# Altium project trusted_io_evt2.PrjPcb (part 2 of 2)

## Sheet 05_kbd_pm.SchDoc
size B
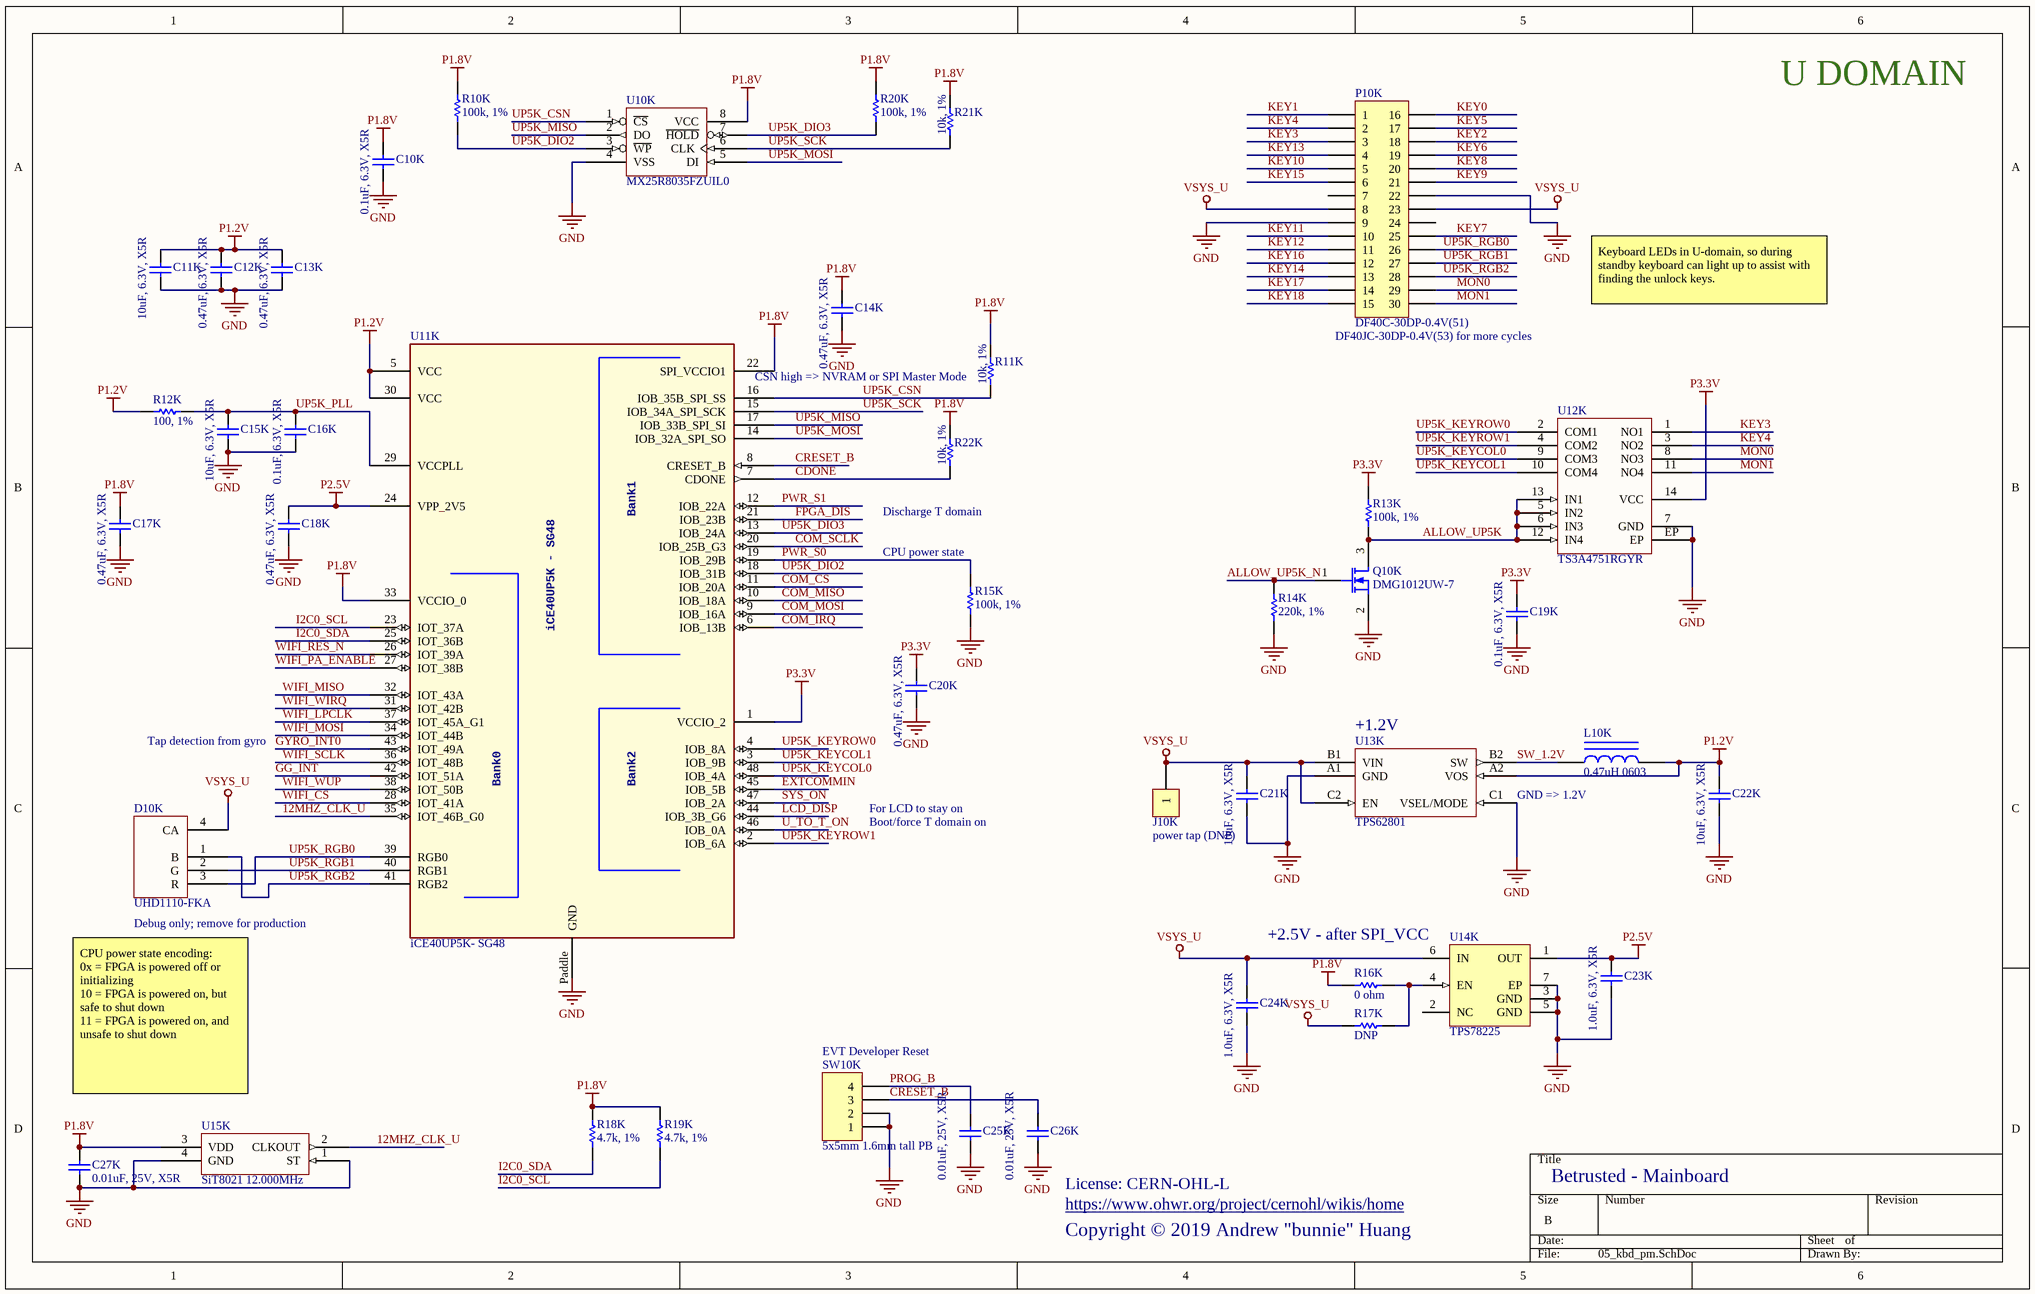
[diagram p6: 05_kbd_pm.SchDoc]

### Parts
C10K  0.1uF, 6.3V, X5R  [B_CAP0201]
C11K  10uF, 6.3V, X5R  [B_CAP0603]
C12K  0.47uF, 6.3V, X5R  [B_CAP0201]
C13K  0.47uF, 6.3V, X5R  [B_CAP0201]
C14K  0.47uF, 6.3V, X5R  [B_CAP0201]
C15K  10uF, 6.3V, X5R  [B_CAP0603]
C16K  0.1uF, 6.3V, X5R  [B_CAP0201]
C17K  0.47uF, 6.3V, X5R  [B_CAP0201]
C18K  0.47uF, 6.3V, X5R  [B_CAP0201]
C19K  0.1uF, 6.3V, X5R  [B_CAP0201]
C20K  0.47uF, 6.3V, X5R  [B_CAP0201]
C21K  10uF, 6.3V, X5R  [B_CAP0603]
C22K  10uF, 6.3V, X5R  [B_CAP0603]
C23K  1.0uF, 6.3V, X5R  [B_CAP0201]
C24K  1.0uF, 6.3V, X5R  [B_CAP0201]
C25K  0.01uF, 25V, X5R  [B_RES0201]
C26K  0.01uF, 25V, X5R  [B_RES0201]
C27K  0.01uF, 25V, X5R  [B_RES0201]
D10K  UHD1110-FKA  [CREE_UHD1110-FKA]
J10K  power tap (DNP)  [RESTAP-0603]
L10K  0.47uH 0603  [B_IND0603]
P10K  DF40C-30DP-0.4V(51)  [HRS_DF40C-30DP-0.4V(51)]
Q10K  DMG1012UW-7  [SOT323-3AN]
R10K  100k, 1%  [B_RES0201]
R11K  10k, 1%  [B_RES0201]
R12K  100, 1%  [B_RES0402]
R13K  100k, 1%  [B_RES0201]
R14K  220k, 1%  [B_RES0201]
R15K  100k, 1%  [B_RES0201]
R16K  0 ohm  [B_RES0201]
R17K  DNP  [B_RES0201]
R18K  4.7k, 1%  [B_RES0201]
R19K  4.7k, 1%  [B_RES0201]
R20K  100k, 1%  [B_RES0201]
R21K  10k, 1%  [B_RES0201]
R22K  10k, 1%  [B_RES0201]
SW10K  5x5mm 1.6mm tall PB  [SWITCH_TS-1187A]
U10K  MX25R8035FZUIL0  [USON-8]
U11K  iCE40UP5K- SG48  [UP5K_QFN127P600-8N]
U12K  TS3A4751RGYR  [TI_RGY_S_PVQFN-N14]
U13K  TPS62801  [BGA6C35P2X3_70X105X40_NSMD]
U14K  TPS78225  [TI-DRV6-1600X1000TP_V]
U15K  SiT8021 12.000MHz  [SiTIME_CSP]

### Nets
GND: C10K.2 C11K.2 C12K.2 C13K.2 C14K.2 C15K.2 C16K.2 C17K.2 C18K.2 C19K.2 C20K.2 C21K.2 C22K.2 C23K.2 C24K.2 C25K.2 C26K.2 C27K.2 P10K.9 P10K.22 Q10K.2(S) R14K.1 R15K.1 SW10K.1 SW10K.2 U10K.4(VSS) U11K.Paddle(GND) U12K.7(GND) U12K.EP U13K.A1(GND) U13K.C1(VSEL/MODE) U14K.3(GND) U14K.5(GND) U14K.7(EP) U15K.1(ST) U15K.4(GND)
P1.2V: C11K.1 C12K.1 C13K.1 C22K.1 L10K.2 R12K.2 U11K.5(VCC) U11K.30(VCC) U13K.A2(VOS)
P1.8V: C10K.1 C14K.1 C17K.1 C27K.1 R10K.2 R11K.1 R16K.1 R18K.2 R19K.2 R20K.2 R21K.1 R22K.1 U10K.8(VCC) U11K.22(SPI_VCCIO1) U11K.33(VCCIO_0) U15K.3(VDD)
P2.5V: C18K.1 C23K.1 U11K.24(VPP_2V5) U14K.1(OUT)
P3.3V: C19K.1 C20K.1 R13K.2 U11K.1(VCCIO_2) U12K.14(VCC)
VSYS_U: C21K.1 C24K.1 D10K.4(CA) J10K.1 P10K.8 P10K.23 R17K.1 U13K.B1(VIN) U13K.C2(EN) U14K.6(IN)
12MHZ_CLK_U: U11K.35(IOT_46B_G0) U15K.2(CLKOUT)
ALLOW_UP5K: Q10K.3(D) R13K.1 U12K.5(IN2) U12K.6(IN3) U12K.12(IN4) U12K.13(IN1)
ALLOW_UP5K_N: Q10K.1(G) R14K.2
CDONE: R22K.2 U11K.7(CDONE)
COM_CS: U11K.11(IOB_20A)
COM_IRQ: U11K.6(IOB_13B)
COM_MISO: U11K.10(IOB_18A)
COM_MOSI: U11K.9(IOB_16A)
COM_SCLK: U11K.20(IOB_25B_G3)
CRESET_B: C26K.1 SW10K.3 U11K.8(CRESET_B)
EXTCOMMIN: U11K.45(IOB_5B)
FPGA_DIS: U11K.21(IOB_23B)
GG_INT: U11K.42(IOT_51A)
GYRO_INT0: U11K.43(IOT_49A)
I2C0_SCL: R19K.1 U11K.23(IOT_37A)
I2C0_SDA: R18K.1 U11K.25(IOT_36B)
KEY0: P10K.16
KEY1: P10K.1
KEY2: P10K.18
KEY3: P10K.3 U12K.1(NO1)
KEY4: P10K.2 U12K.3(NO2)
KEY5: P10K.17
KEY6: P10K.19
KEY7: P10K.25
KEY8: P10K.20
KEY9: P10K.21
KEY10: P10K.5
KEY11: P10K.10
KEY12: P10K.11
KEY13: P10K.4
KEY14: P10K.13
KEY15: P10K.6
KEY16: P10K.12
KEY17: P10K.14
KEY18: P10K.15
LCD_DISP: U11K.44(IOB_3B_G6)
MON0: P10K.29 U12K.8(NO3)
MON1: P10K.30 U12K.11(NO4)
PROG_B: C25K.1 SW10K.4
PWR_S0: R15K.2 U11K.19(IOB_29B)
PWR_S1: U11K.12(IOB_22A)
SW_1.2V: L10K.1 U13K.B2(SW)
SYS_ON: U11K.47(IOB_2A)
U_TO_T_ON: U11K.46(IOB_0A)
UP5K_CSN: R11K.2 U10K.1(~{CS}) U11K.16(IOB_35B_SPI_SS)
UP5K_DIO2: R10K.1 U10K.3(~{WP}) U11K.18(IOB_31B)
UP5K_DIO3: R20K.1 U10K.7(~{HOLD}) U11K.13(IOB_24A)
UP5K_KEYCOL0: U11K.48(IOB_4A) U12K.9(COM3)
UP5K_KEYCOL1: U11K.3(IOB_9B) U12K.10(COM4)
UP5K_KEYROW0: U11K.4(IOB_8A) U12K.2(COM1)
UP5K_KEYROW1: U11K.2(IOB_6A) U12K.4(COM2)
UP5K_MISO: U10K.2(DO) U11K.17(IOB_33B_SPI_SI)
UP5K_MOSI: U10K.5(DI) U11K.14(IOB_32A_SPI_SO)
UP5K_PLL: C15K.1 C16K.1 R12K.1 U11K.29(VCCPLL)
UP5K_RGB0: D10K.3(R) P10K.26 U11K.39(RGB0)
UP5K_RGB1: D10K.2(G) P10K.27 U11K.40(RGB1)
UP5K_RGB2: D10K.1(B) P10K.28 U11K.41(RGB2)
UP5K_SCK: R21K.2 U10K.6(CLK) U11K.15(IOB_34A_SPI_SCK)
WIFI_CS: U11K.28(IOT_41A)
WIFI_LPCLK: U11K.37(IOT_45A_G1)
WIFI_MISO: U11K.32(IOT_43A)
WIFI_MOSI: U11K.34(IOT_44B)
WIFI_PA_ENABLE: U11K.27(IOT_38B)
WIFI_RES_N: U11K.26(IOT_39A)
WIFI_SCLK: U11K.36(IOT_48B)
WIFI_WIRQ: U11K.31(IOT_42B)
WIFI_WUP: U11K.38(IOT_50B)
NetR16K_2: R16K.2 R17K.2 U14K.4(EN)

Not connected (* = marked no-connect by the designer): P10K 7 24; U14K 2(NC)

### Notes on the sheet
- U DOMAIN
- Keyboard LEDs in U-domain, so during standby keyboard can light up to assist with finding the unlock keys.
- (near P10K) DF40JC-30DP-0.4V(53) for more cycles
- CSN high => NVRAM or SPI Master Mode
- (near R15K) CPU power state
- (near R22K) Discharge T domain
- Tap detection from gyro
- (near U13K) +1.2V
- Boot/force T domain on
- For LCD to stay on
- GND => 1.2V
- (near D10K) Debug only; remove for production
- (near U14K) +2.5V - after SPI_VCC
- CPU power state encoding:
  0x = FPGA is powered off or initializing
  10 = FPGA is powered on, but safe to shut down
  11 = FPGA is powered on, and unsafe to shut down
- (near SW10K) EVT Developer Reset
- Betrusted - Mainboard
- (near C26K) License: CERN-OHL-L
- Copyright © 2019 Andrew "bunnie" Huang
- https://www.ohwr.org/project/cernohl/wikis/home
- (in symbol iCE40UP5K- SG48) Bank1; iCE40UP5K - SG48; Bank0; Bank2

### Library data of the parts
C10K C16K C19K = Cap Semi: as C12F on sheet 01_fpga
C11K C15K C21K C22K = Cap Semi: as C11F on sheet 01_fpga
C12K C13K C14K C17K C18K C20K = Cap Semi: Capacitor (Semiconductor SIM Model); MPN: CL03A474KQ3NNNH; VENDOR: Samsung; MYPN: C-474-6p3-X5R-0201
C23K C24K = Cap Semi: as C22F on sheet 01_fpga
C25K C26K C27K = Cap Semi: Capacitor (Semiconductor SIM Model); MPN: GRM033R61E103KA12D; VENDOR: Murata; MYPN: C-103-25-X5R-0201
D10K = CREE_UHD1110-FKA: 1x1mm SMD RGB LED, 5mA, common anode; MPN: UHD1110-FKA-CL1A13R3Q1BBQFMF3; VENDOR: Cree; MYPN: UHD1110-FKA
J10K = CON1: Connector; MYPN: J-TP-PWRTAP-0603; MPN: DNP; VENDOR: DNP
L10K = Inductor Iron: Magnetic-Core Inductor; MPN: TFM160808ALC-R47MTAA; VENDOR: TDK; MYPN: L-TFM160808ALC-R47MTAA
P10K = Header 15X2A: Header, 15-Pin, Dual row; MYPN: J-DF40C-30DP-0.4V(51) or DF40JC-30DP-0.4V(53); VENDOR: Hirose; System: Connector; LatestRevisionDate: 17-Jul-2002; LatestRevisionNote: Re-released for DXP Platform.; Publisher: Altium Limited; MPN: DF40C-30DP-0.4V(51)
Q10K = MOSFET-N: as Q11F on sheet 01_fpga; Published: 8-Jun-2000; LatestRevisionDate: 17-Jul-2002; LatestRevisionNote: Re-released for DXP Platform.; PackageVersion: 1995/1996; PackageReference: E3; Publisher: Altium Limited; MPN: DMG1012UW-7
R10K R13K R15K R20K = Res1: as R14F on sheet 01_fpga; MPN: ANY
R11K R21K R22K = Res1: Resistor; VENDOR: ANY; MYPN: R-103-1P-1_16W-0201; MPN: ANY
R12K = Res1: Resistor; VENDOR: ANY; MYPN: R-101-1P-1_16W-0402; MPN: ANY
R14K = Res1: as R10F on sheet 01_fpga; MPN: ANY
R16K = Res1: Resistor; VENDOR: ANY; MYPN: R-0R0-1P-1_16W-0201; MPN: ANY
R17K = Res1: Resistor; VENDOR: ANY; MYPN: DNP; MPN: ANY
R18K R19K = Res1: Resistor; VENDOR: ANY; MYPN: R-472-1P-1_16W-0201; MPN: ANY
SW10K = Header 4: Chi Fung TS-1187A; MPN: RS-187R05A2-DS MT RT; VENDOR: C&K; MYPN: SW-PB-5X5-1.6; LatestRevisionDate: 17-Jul-2002; LatestRevisionNote: Re-released for DXP Platform.; Publisher: Altium Limited
U10K = EN25P05-50GCP: 64Mbit SPI NOR FLASH; MYPN: UMX25R8035FZUIL0; VENDOR: Macronix; MPN: MX25R8035FZUIL0
U12K = TS3A4751RGYR: 0.9 ohm low voltage, single supply, 4-channel SPST analog switch; MYPN: U-TS3A4751RGYR; VENDOR: TI; MPN: TS3A4751RGYR
U13K = TPS62801: Buck regulator, 4MHz, 0.6A, 0.8V-1.55V, low Iq; MPN: TPS62801YKAT; VENDOR: TI; MYPN: U-TPS62801YKA(T/R)
U14K = TI-TPS78225-Q1DRV6-1600X1000TP: 500nA Iq, 150mA LDO; MPN: TPS78225DRVT; VENDOR: TI; MYPN: U-TPS78225DRV(T/R)
U15K = SiT8021: 1 to 26 MHz micropower oscillator; MPN: SIT8021AI-J4-18S-12.000000E; VENDOR: SiTime; MYPN: U-SIT8021AI-J4-18S-12.000000E

## Sheet 07_ux.SchDoc
size B
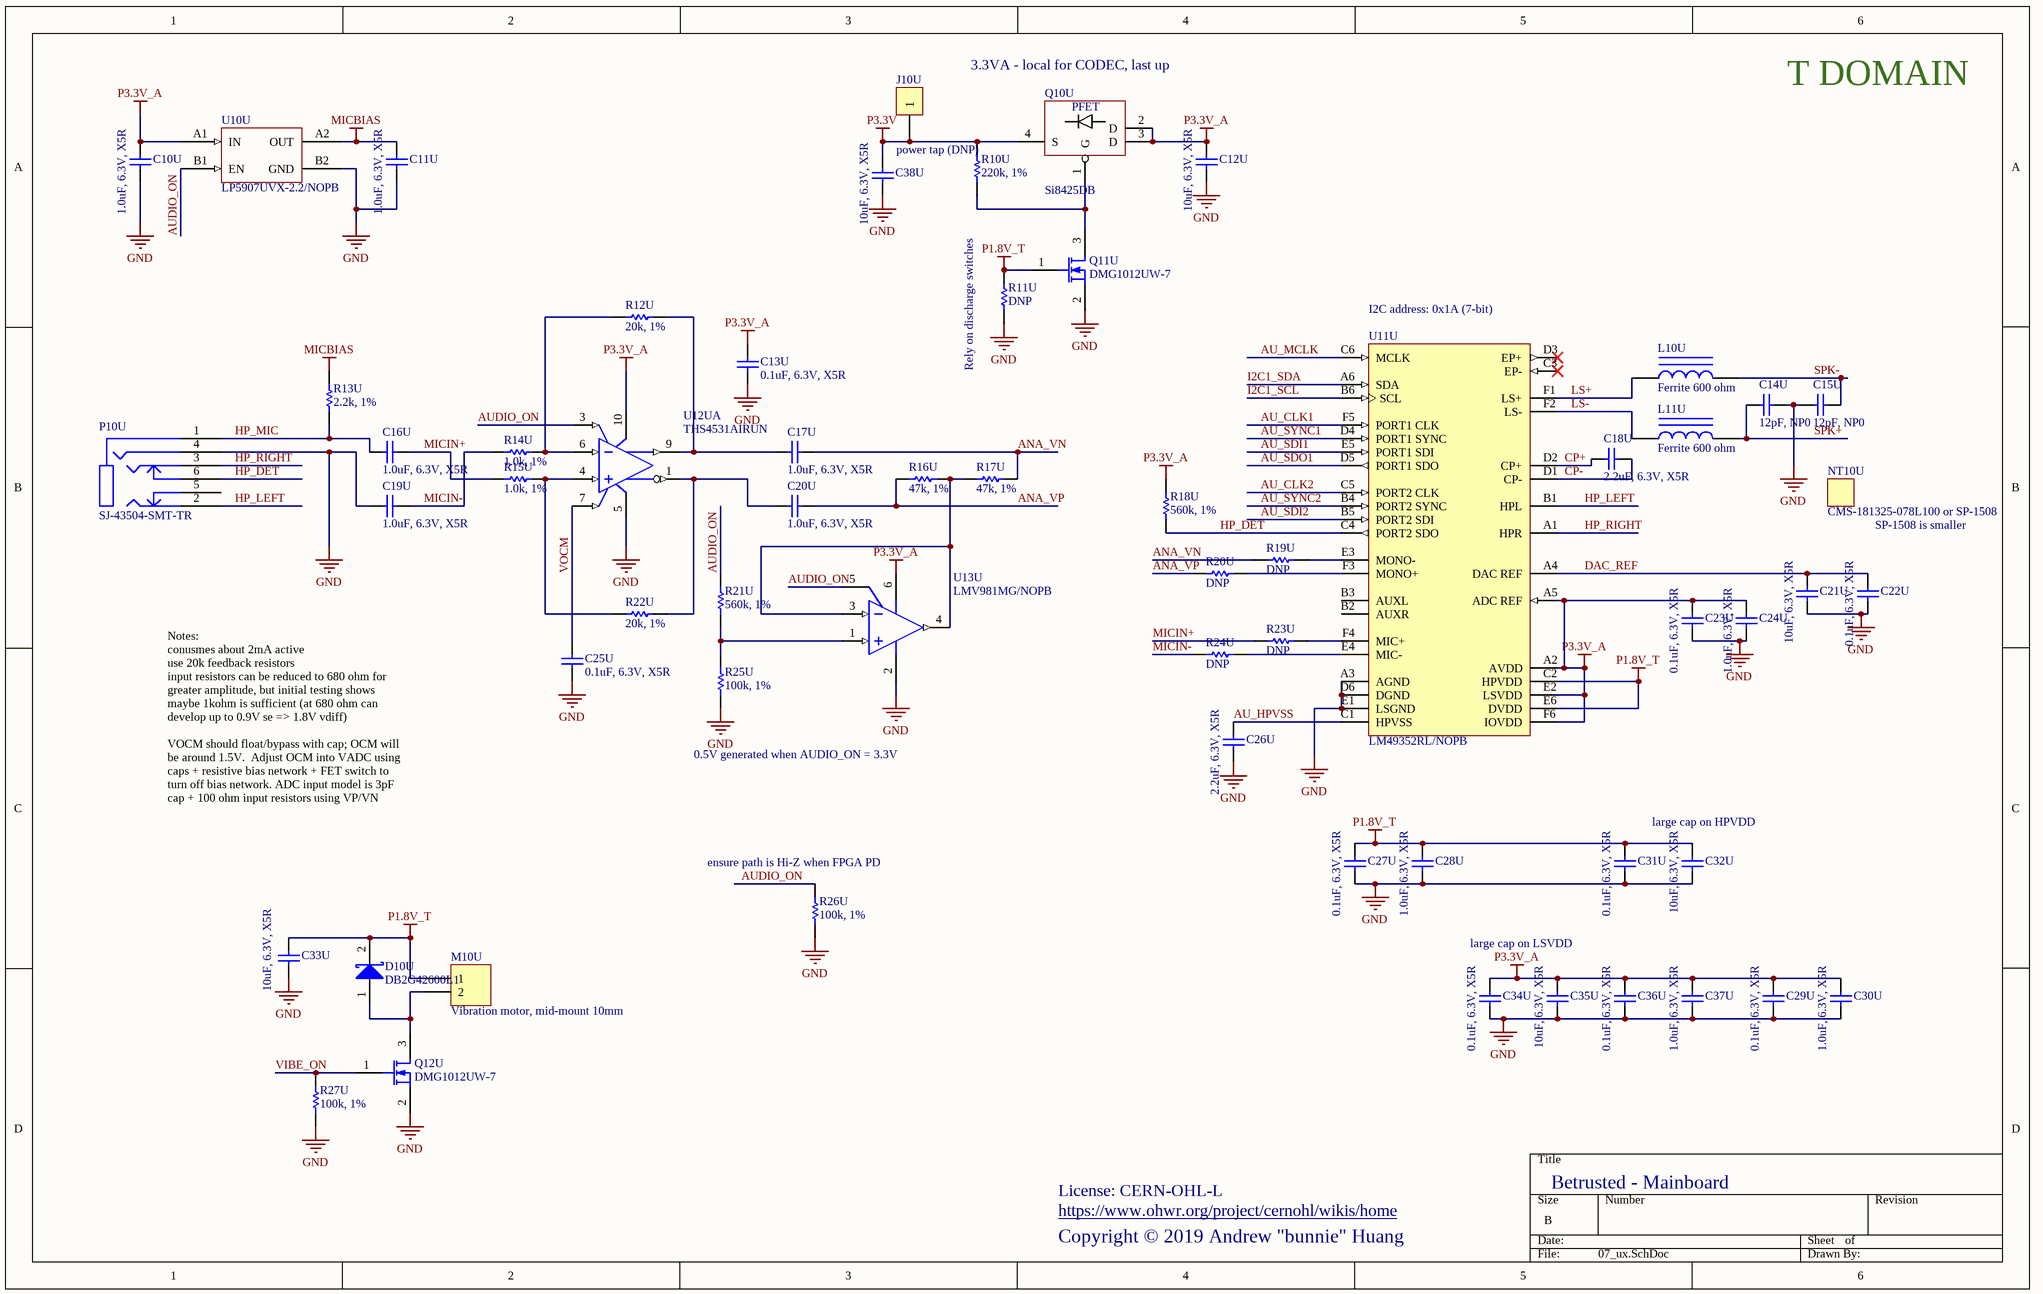
[diagram p7: 07_ux.SchDoc]

### Parts
C10U  1.0uF, 6.3V, X5R  [B_CAP0201]
C11U  1.0uF, 6.3V, X5R  [B_CAP0201]
C12U  10uF, 6.3V, X5R  [B_CAP0603]
C13U  0.1uF, 6.3V, X5R  [B_CAP0201]
C14U  12pF, NP0  [B_CAP0201]
C15U  12pF, NP0  [B_CAP0201]
C16U  1.0uF, 6.3V, X5R  [B_CAP0201]
C17U  1.0uF, 6.3V, X5R  [B_CAP0201]
C18U  2.2uF, 6.3V, X5R  [B_CAP0402]
C19U  1.0uF, 6.3V, X5R  [B_CAP0201]
C20U  1.0uF, 6.3V, X5R  [B_CAP0201]
C21U  10uF, 6.3V, X5R  [B_CAP0603]
C22U  0.1uF, 6.3V, X5R  [B_CAP0201]
C23U  0.1uF, 6.3V, X5R  [B_CAP0201]
C24U  1.0uF, 6.3V, X5R  [B_CAP0201]
C25U  0.1uF, 6.3V, X5R  [B_CAP0201]
C26U  2.2uF, 6.3V, X5R  [B_CAP0402]
C27U  0.1uF, 6.3V, X5R  [B_CAP0201]
C28U  1.0uF, 6.3V, X5R  [B_CAP0201]
C29U  0.1uF, 6.3V, X5R  [B_CAP0201]
C30U  1.0uF, 6.3V, X5R  [B_CAP0201]
C31U  0.1uF, 6.3V, X5R  [B_CAP0201]
C32U  10uF, 6.3V, X5R  [B_CAP0603]
C33U  10uF, 6.3V, X5R  [B_CAP0603]
C34U  0.1uF, 6.3V, X5R  [B_CAP0201]
C35U  10uF, 6.3V, X5R  [B_CAP0603]
C36U  0.1uF, 6.3V, X5R  [B_CAP0201]
C37U  1.0uF, 6.3V, X5R  [B_CAP0201]
C38U  10uF, 6.3V, X5R  [B_CAP0603]
D10U  DB2G42600L1  [B_DIO0402]
J10U  power tap (DNP)  [RESTAP-0603]
L10U  Ferrite 600 ohm  [B_IND0603]
L11U  Ferrite 600 ohm  [B_IND0603]
M10U  Vibration motor, mid-mount 10mm  [JINLONG-C1020K001F]
NT10U  CMS-181325-078L100 or SP-1508
P10U  SJ-43504-SMT-TR  [CUI_SJ_43504_SMT_TR_FLIP]
Q10U  Si8425DB  [VISHAY_MICRO_FOOT_4_BUMP]
Q11U  DMG1012UW-7  [SOT323-3AN]
Q12U  DMG1012UW-7  [SOT323-3AN]
R10U  220k, 1%  [B_RES0201]
R11U  DNP  [B_RES0201]
R12U  20k, 1%  [B_RES0201]
R13U  2.2k, 1%  [B_RES0201]
R14U  1.0k, 1%  [B_RES0201]
R15U  1.0k, 1%  [B_RES0201]
R16U  47k, 1%  [B_RES0201]
R17U  47k, 1%  [B_RES0201]
R18U  560k, 1%  [B_RES0201]
R19U  DNP  [B_RES0201]
R20U  DNP  [B_RES0201]
R21U  560k, 1%  [B_RES0201]
R22U  20k, 1%  [B_RES0201]
R23U  DNP  [B_RES0201]
R24U  DNP  [B_RES0201]
R25U  100k, 1%  [B_RES0201]
R26U  100k, 1%  [B_RES0201]
R27U  100k, 1%  [B_RES0201]
U10U  LP5907UVX-2.2/NOPB  [TI_YKE004]
U11U  LM49352RL/NOPB  [YPG0036AWAW]
U12U  THS4531AIRUN  [RUN0010A]  (part A of 2)
U13U  LMV981MG/NOPB  [DCK0006A_N]

### Nets
GND: C10U.2 C11U.2 C12U.2 C13U.1 C14U.2 C15U.1 C19U.1 C21U.2 C22U.2 C23U.2 C24U.1 C25U.1 C26U.1 C27U.2 C28U.1 C29U.2 C30U.1 C31U.2 C32U.2 C33U.1 C34U.2 C35U.2 C36U.2 C37U.1 C38U.2 P10U.4(RING2) Q11U.2(S) Q12U.2(S) R11U.1 R25U.1 R26U.1 R27U.1 U10U.B2(GND) U11U.A3(AGND) U11U.D6(DGND) U11U.E1(LSGND) U12U.5(VS-) U13U.2(GND)
MICBIAS: C11U.1 R13U.2 U10U.A2(OUT)
P1.8V_T: C27U.1 C28U.2 C31U.1 C32U.1 C33U.2 D10U.2(K) M10U.1 Q11U.1(G) R11U.2 U11U.C2(HPVDD) U11U.E6(DVDD)
P3.3V: C38U.1 J10U.1 Q10U.4(S) R10U.2
P3.3V_A: C10U.1 C12U.1 C13U.2 C23U.1 C24U.2 C29U.1 C30U.2 C34U.1 C35U.1 C36U.1 C37U.2 Q10U.2(D) Q10U.3(D) R18U.2 U10U.A1(IN) U11U.A2(AVDD) U11U.A5(ADC_REF) U11U.E2(LSVDD) U11U.F6(IOVDD) U12U.10(VS+) U13U.6(VDD)
ANA_VN: C17U.2 R17U.1 R19U.2
ANA_VP: C20U.2 R16U.2 R20U.2
AU_CLK1: U11U.F5(PORT1_CLK)
AU_CLK2: U11U.C5(PORT2_CLK)
AU_HPVSS: C26U.2 U11U.C1(HPVSS)
AU_MCLK: U11U.C6(MCLK)
AU_SDI1: U11U.E5(PORT1_SDI)
AU_SDI2: U11U.B5(PORT2_SDI)
AU_SDO1: U11U.D5(PORT1_SDO)
AU_SYNC1: U11U.D4(PORT1_SYNC)
AU_SYNC2: U11U.B4(PORT2_SYNC)
AUDIO_ON: R21U.2 R26U.2 U10U.B1(EN) U12U.3(~{PD}) U13U.5(~{SHDN})
CP+: C18U.2 U11U.D2(CP+)
CP-: C18U.1 U11U.D1(CP-)
DAC_REF: C21U.1 C22U.1 U11U.A4(DAC_REF)
HP_DET: P10U.6(RING1_SW) R18U.1 U11U.C4(PORT2_SDO)
HP_LEFT: P10U.2(TIP) U11U.B1(HPL)
HP_MIC: C16U.1 P10U.1(SLEEVE) R13U.1
HP_RIGHT: P10U.3(RING1) U11U.A1(HPR)
I2C1_SCL: U11U.B6(SCL)
I2C1_SDA: U11U.A6(SDA)
LS+: L10U.1 U11U.F1(LS+)
LS-: L11U.1 U11U.F2(LS-)
MICIN+: C16U.2 R15U.2 R23U.2
MICIN-: C19U.2 R14U.2 R24U.2
SPK+: C14U.1 L11U.2
SPK-: C15U.2 L10U.2
VIBE_ON: Q12U.1(G) R27U.2
VOCM: C25U.2 U12U.7(VOCM)
NetC17U_1: C17U.1 R12U.1 U12U.9(VOUT+)
NetC20U_1: C20U.1 R22U.1 U12U.1(VOUT-)
NetD10U_1: D10U.1(A) M10U.2 Q12U.3(D)
NetQ10U_1: Q10U.1(G) Q11U.3(D) R10U.1
NetR12U_2: R12U.2 R14U.1 U12U.6(VIN-)
NetR15U_1: R15U.1 R22U.2 U12U.4(VIN+)
NetR16U_1: R16U.1 R17U.2 U13U.3(IN-) U13U.4(OUT)
NetR19U_1: R19U.1 U11U.E3(MONO-)
NetR20U_1: R20U.1 U11U.F3(MONO+)
NetR21U_1: R21U.1 R25U.2 U13U.1(IN+)
NetR23U_1: R23U.1 U11U.F4(MIC+)
NetR24U_1: R24U.1 U11U.E4(MIC-)

Not connected (* = marked no-connect by the designer): P10U 5(TIP_SW); U11U B2(AUXR) B3(AUXL) C3(EP-)* D3(EP+)*

### Notes on the sheet
- 3.3VA - local for CODEC, last up
- T DOMAIN
- Rely on discharge switches
- (near U11U) I2C address: 0x1A (7-bit)
- SP-1508 is smaller
- 0.5V generated when AUDIO_ON = 3.3V
- Notes:
  conusmes about 2mA active
  use 20k feedback resistors
  input resistors can be reduced to 680 ohm for greater amplitude, but initial testing shows maybe 1kohm is sufficient (at 680 ohm can develop up to 0.9V se => 1.8V vdiff)
  VOCM should float/bypass with cap; OCM will be around 1.5V.  Adjust OCM into VADC using caps + resistive bias network + FET switch to turn off bias network. ADC input model is 3pF cap + 100 ohm input resistors using VP/VN
- large cap on HPVDD
- (near R26U) ensure path is Hi-Z when FPGA PD
- large cap on LSVDD
- License: CERN-OHL-L
- Copyright © 2019 Andrew "bunnie" Huang
- https://www.ohwr.org/project/cernohl/wikis/home
- Betrusted - Mainboard
- (in symbol Si8425DB) PFET

### Library data of the parts
C10U C11U C16U C17U C19U C20U = Cap Semi: Capacitor (Semiconductor SIM Model); MPN: GRM033R60J105MEA2D; VENDOR: Murata; MYPN: C-105-6p3-X5R-0603
C12U C21U C32U C33U C35U C38U = Cap Semi: Capacitor (Semiconductor SIM Model); MPN: CL10A106MQ8NNNC; VENDOR: Samsung; MYPN: C-106-6.3-X5R-0603
C13U C22U C23U C25U C27U C29U C31U C34U C36U = Cap Semi: Capacitor (Semiconductor SIM Model); MPN: CL03A104KQ3NNNC; VENDOR: Samsung; MYPN: C-104-6p3-X5R-0201
C14U C15U = Cap Semi: Capacitor (Semiconductor SIM Model); MPN: GRM0335C1E120JA01D; VENDOR: Murata; MYPN: C-120-25-NP0-0201
C18U C26U = Cap Semi: Capacitor (Semiconductor SIM Model); MPN: CL05A225MQ5NNNC; VENDOR: Samsung; MYPN: C-225-6p3-X5R-0402
C24U C28U C30U C37U = Cap Semi: Capacitor (Semiconductor SIM Model); MPN: GRM033R60J105MEA2D; VENDOR: Murata; MYPN: C-105-6p3-X5R-0201
D10U = Diode 11DQ03: Schottky Rectifier; MYPN: D-SCHOTTKY-0402-CSP; VENDOR: Panasonic; ComponentLink1Description: Manufacturer Link; ComponentLink1URL: http://www.irf.com/; ComponentLink2Description: Datasheet; ComponentLink2URL: http://www.irf.com/product-info/datasheets/data/11dq03.pdf; MPN: DB2G42600L1
J10U = CON1: Connector; MYPN: J-TP-PWRTAP-0603; MPN: DNP; VENDOR: DNP
L10U L11U = Inductor Iron: Magnetic-Core Inductor; MPN: BLM18AG601SN1D; VENDOR: Murata; MYPN: L-BLM18AG601SN1D
M10U = Header 2: MPN: C1020K001F; VENDOR: Jinlong; MYPN: M-VIBE-10MM-MID; LatestRevisionDate: 17-Jul-2002; LatestRevisionNote: Re-released for DXP Platform.; Publisher: Altium Limited
NT10U = NOTE: Placeholder for non-board BOM items; MYPN: NT-CUI-SPEAKER; VENDOR: CUI or Soberton; MPN: CMS-181325-078L100 or SP-1508
P10U = CUI_3.5MM_STEREO_MIC: Mid mount audio jack; VENDOR: CUI; MYPN: J-3.5MM-MID-CUI; MPN: SJ-43504-SMT-TR
Q10U = Si8425DB: P-channel 20V 6.2A 27mOhm @ -2.5V; MPN: SI8457DB-T1-E1; VENDOR: Vishay Siliconix; MYPN: Q-Si8457
Q11U Q12U = MOSFET-N: N-Channel MOSFET; VENDOR: Diodes Inc; MYPN: Q-DMG1012UW-7; Published: 8-Jun-2000; LatestRevisionDate: 17-Jul-2002; LatestRevisionNote: Re-released for DXP Platform.; PackageVersion: 1995/1996; PackageReference: E3; Publisher: Altium Limited; MPN: DMG1012UW-7
R10U = Res1: Resistor; VENDOR: ANY; MYPN: R-224-1P-1_16W-0201; MPN: ANY
R11U R19U R20U R23U R24U = Res1: Resistor; VENDOR: ANY; MYPN: DNP; MPN: ANY
R12U R22U = Res1: Resistor; VENDOR: ANY; MYPN: R-203-1P-1_16W-0201; MPN: ANY
R13U = Res1: Resistor; VENDOR: ANY; MYPN: R-222-1P-1_16W-0201; MPN: ANY
R14U R15U = Res1: Resistor; VENDOR: ANY; MYPN: R-102-1P-1_16W-0201; MPN: ANY
R16U R17U = Res1: Resistor; VENDOR: ANY; MYPN: R-473-1P-1_16W-0201; MPN: ANY
R18U R21U = Res1: Resistor; VENDOR: ANY; MYPN: R-564-1P-1_16W-0201; MPN: ANY
R25U R26U R27U = Res1: Resistor; VENDOR: ANY; MYPN: R-104-1P-1_16W-0201; MPN: ANY
U10U = LP5907UVX: Ultra low-noise 250mA LDO for RF and analog in DSBGA; VENDOR: TI; MYPN: ULP5907UVX-2.2; MPN: LP5907UVX-2.2/NOPB
U11U = AMP-AUDA-LM49352-36: MYPN: U-LM49352RL/NOPB; VENDOR: TI; MPN: LM49352RL/NOPB
U12U = TI-THS4531X-RUN10: Ultra Low-Power, RRIO, Fully Differential Amplifier; MPN: THS4531AIRUNT; VENDOR: TI; MYPN: U-THS4531AIRUN(T/R)
U13U = CMP-0055-01099-3: Single 1.8V, RRIO Operational Amplifiers with Shutdown, 6-pin SC-70, Pb-Free; PowerWise: N; PackageTopMarking: A77*XTT; VENDOR: Texas Instruments; ComponentLink1URL: http://www.ti.com/general/docs/lit/getliterature.tsp?genericPartNumber=LMV981-N&fileType=pdf; PackageDescription: Molded SC-70, 2 x 1.25 x .9mm, 6 Lead, 0.65mm Pitch; RoHS: Y; PinCount: 6; ComponentLink1Description: Datasheet URL; CompType: Amplifiers; Package Reference: DCK0006A; MPN: LMV981MG/NOPB

## Nets that join several sheets
GND: 01_fpga (163 pins), 02_memory (17 pins), 03_power (54 pins), 04_io (35 pins), 05_kbd_pm (36 pins), 07_ux (38 pins)
P1.2V: 03_power (R19P.1), 05_kbd_pm (9 pins)
P1.8V: 01_fpga (5 pins), 02_memory (13 pins), 03_power (9 pins), 04_io (16 pins), 05_kbd_pm (16 pins)
P1.8V_T: 01_fpga (62 pins), 02_memory (8 pins), 03_power (D10P.2 D11P.2), 07_ux (11 pins)
P3.3V: 03_power (C24P.1 L12P.2 U13P.A2), 04_io (L13W.2), 05_kbd_pm (5 pins), 07_ux (C38U.1 J10U.1 Q10U.4 R10U.2)
P3.3V_A: 01_fpga (21 pins), 07_ux (21 pins)
P5.0V: 03_power (C28P.1 C29P.1 U15P.B2), 04_io (5 pins)
PACK_P: 01_fpga (P11F.4 P11F.5 P11F.6), 03_power (C21P.2 J11P.1 TP10P.1 U11P.C3)
VBAT: 01_fpga (6 pins), 03_power (9 pins)
VBUS: 01_fpga (5 pins), 03_power (12 pins)
VSYS_U: 03_power (14 pins), 05_kbd_pm (10 pins)
ALLOW_UP5K_N: 01_fpga (U11F.U7), 05_kbd_pm (Q10K.1 R14K.2)
ANA_VN: 01_fpga (U11F.K9), 07_ux (C17U.2 R17U.1 R19U.2)
ANA_VP: 01_fpga (U11F.J10), 07_ux (C20U.2 R16U.2 R20U.2)
AU_CLK1: 01_fpga (U11F.D14), 07_ux (U11U.F5)
AU_CLK2: 01_fpga (U11F.F14), 07_ux (U11U.C5)
AU_MCLK: 01_fpga (U11F.D18), 07_ux (U11U.C6)
AU_SDI1: 01_fpga (U11F.D12), 07_ux (U11U.E5)
AU_SDI2: 01_fpga (U11F.A15), 07_ux (U11U.B5)
AU_SDO1: 01_fpga (U11F.C13), 07_ux (U11U.D5)
AU_SYNC1: 01_fpga (U11F.B15), 07_ux (U11U.D4)
AU_SYNC2: 01_fpga (U11F.B17), 07_ux (U11U.B4)
AUDIO_ON: 01_fpga (U11F.G13), 07_ux (5 pins)
COM_CS: 01_fpga (U11F.T15), 05_kbd_pm (U11K.11)
COM_IRQ: 01_fpga (U11F.M16), 05_kbd_pm (U11K.6)
COM_MISO: 01_fpga (U11F.P16), 05_kbd_pm (U11K.10)
COM_MOSI: 01_fpga (U11F.N18), 05_kbd_pm (U11K.9)
COM_SCLK: 01_fpga (U11F.R16), 05_kbd_pm (U11K.20)
CRESET_B: 01_fpga (P12F.4), 03_power (R22P.1 U14P.1), 05_kbd_pm (C26K.1 SW10K.3 U11K.8)
EXTCOMMIN: 04_io (P12W.4), 05_kbd_pm (U11K.45)
FPGA_DIS: 01_fpga (Q14F.1 Q15F.1 R23F.2), 05_kbd_pm (U11K.21)
GG_INT: 03_power (R18P.2 U11P.A1), 05_kbd_pm (U11K.42)
GYRO_INT0: 04_io (U14W.4), 05_kbd_pm (U11K.43)
I2C0_SCL: 01_fpga (P11F.18), 03_power (U10P.A4 U11P.A3), 04_io (U14W.13), 05_kbd_pm (R19K.1 U11K.23)
I2C0_SDA: 01_fpga (P11F.17), 03_power (U10P.B4 U11P.A2), 04_io (U14W.14), 05_kbd_pm (R18K.1 U11K.25)
I2C1_SCL: 01_fpga (R26F.1 U11F.C14 U18F.3), 07_ux (U11U.B6)
I2C1_SDA: 01_fpga (R25F.1 U11F.A14 U18F.4), 07_ux (U11U.A6)
KEY0: 01_fpga (U11F.F15), 05_kbd_pm (P10K.16)
KEY1: 01_fpga (U11F.E17), 05_kbd_pm (P10K.1)
KEY2: 01_fpga (U11F.G17), 05_kbd_pm (P10K.18)
KEY3: 01_fpga (U11F.E14), 05_kbd_pm (P10K.3 U12K.1)
KEY4: 01_fpga (U11F.E15), 05_kbd_pm (P10K.2 U12K.3)
KEY5: 01_fpga (U11F.H15), 05_kbd_pm (P10K.17)
KEY6: 01_fpga (U11F.G15), 05_kbd_pm (P10K.19)
KEY7: 01_fpga (U11F.H14), 05_kbd_pm (P10K.25)
KEY8: 01_fpga (U11F.H16), 05_kbd_pm (P10K.20)
KEY9: 01_fpga (U11F.H17), 05_kbd_pm (P10K.21)
KEY10: 01_fpga (U11F.E18), 05_kbd_pm (P10K.5)
KEY11: 01_fpga (U11F.F18), 05_kbd_pm (P10K.10)
KEY12: 01_fpga (U11F.G18), 05_kbd_pm (P10K.11)
KEY13: 01_fpga (U11F.E13), 05_kbd_pm (P10K.4)
KEY14: 01_fpga (U11F.H18), 05_kbd_pm (P10K.13)
KEY15: 01_fpga (U11F.F13), 05_kbd_pm (P10K.6)
KEY16: 01_fpga (U11F.H13), 05_kbd_pm (P10K.12)
KEY17: 01_fpga (U11F.J13), 05_kbd_pm (P10K.14)
KEY18: 01_fpga (U11F.K13), 05_kbd_pm (P10K.15)
LCD_DISP: 04_io (C28W.1 P12W.5), 05_kbd_pm (U11K.44)
LCD_SCLK: 01_fpga (U11F.A17), 04_io (P12W.1)
LCD_SCS: 01_fpga (U11F.C18), 04_io (P12W.3)
LCD_SI: 01_fpga (U11F.D17), 04_io (P12W.2)
PROG_B: 01_fpga (P12F.21 R24F.1 U11F.R8 U14F.1), 02_memory (U12M.A4), 05_kbd_pm (C25K.1 SW10K.4)
PWR_S0: 01_fpga (R27F.1 U11F.U6 U16F.C2 U17F.C2), 05_kbd_pm (R15K.2 U11K.19)
PWR_S1: 01_fpga (U11F.L13), 05_kbd_pm (U11K.12)
SPINOR_CSN: 01_fpga (U11F.M13), 02_memory (R13M.1 U12M.C2)
SPINOR_DQS: 01_fpga (U11F.R14), 02_memory (U12M.C3)
SPINOR_ECSN: 01_fpga (R30F.2 U11F.L16), 02_memory (U12M.A5)
SPINOR_IO2: 01_fpga (U11F.L14), 02_memory (U12M.C4)
SPINOR_IO3: 01_fpga (U11F.M15), 02_memory (U12M.D4)
SPINOR_IO4: 01_fpga (U11F.L17), 02_memory (U12M.D5)
SPINOR_IO5: 01_fpga (U11F.L18), 02_memory (U12M.E3)
SPINOR_IO6: 01_fpga (U11F.M14), 02_memory (U12M.E2)
SPINOR_IO7: 01_fpga (U11F.N14), 02_memory (U12M.E1)
SPINOR_MISO: 01_fpga (U11F.K18), 02_memory (U12M.D2)
SPINOR_MOSI: 01_fpga (U11F.K17), 02_memory (U12M.D3)
SPINOR_SCK: 01_fpga (U11F.C8), 02_memory (U12M.B2)
SPK+: 01_fpga (P11F.23 P11F.24), 07_ux (C14U.1 L11U.2)
SPK-: 01_fpga (P11F.25 P11F.26), 07_ux (C15U.2 L10U.2)
SRAM_A0: 01_fpga (U11F.V12), 02_memory (U10M.A3 U11M.A3)
SRAM_A1: 01_fpga (U11F.M5), 02_memory (U10M.A4 U11M.A4)
SRAM_A2: 01_fpga (U11F.P5), 02_memory (U10M.A5 U11M.A5)
SRAM_A3: 01_fpga (U11F.N4), 02_memory (U10M.B3 U11M.B3)
SRAM_A4: 01_fpga (U11F.V14), 02_memory (U10M.B4 U11M.B4)
SRAM_A5: 01_fpga (U11F.M3), 02_memory (U10M.C3 U11M.C3)
SRAM_A6: 01_fpga (U11F.R17), 02_memory (U10M.C4 U11M.C4)
SRAM_A7: 01_fpga (U11F.U15), 02_memory (U10M.D4 U11M.D4)
SRAM_A8: 01_fpga (U11F.M4), 02_memory (U10M.H5 U11M.H2)
SRAM_A9: 01_fpga (U11F.L6), 02_memory (U10M.H4 U11M.H3)
SRAM_A10: 01_fpga (U11F.K3), 02_memory (U10M.H3 U11M.H4)
SRAM_A11: 01_fpga (U11F.R18), 02_memory (U10M.H2 U11M.H5)
SRAM_A12: 01_fpga (U11F.U16), 02_memory (U10M.G3 U11M.G3)
SRAM_A13: 01_fpga (U11F.K1), 02_memory (U10M.G2 U11M.G4)
SRAM_A14: 01_fpga (U11F.R5), 02_memory (U10M.F4 U11M.F3)
SRAM_A15: 01_fpga (U11F.T2), 02_memory (U10M.F3 U11M.F4)
SRAM_A16: 01_fpga (U11F.U1), 02_memory (U10M.E3 U11M.E4)
SRAM_A17: 01_fpga (U11F.N1), 02_memory (U10M.D3 U11M.D3)
SRAM_A18: 01_fpga (U11F.L5), 02_memory (U10M.H6 U11M.H1)
SRAM_A19: 01_fpga (U11F.K2), 02_memory (U10M.G4 U11M.G2)
SRAM_A20: 01_fpga (U11F.M18), 02_memory (U10M.H1 U11M.H6)
SRAM_A21: 01_fpga (U11F.T6), 02_memory (U10M.E4 U11M.E3)
SRAM_CE_N_1.8: 01_fpga (U16F.B1), 02_memory (R11M.2 U10M.B5 U11M.B5)
SRAM_D0: 01_fpga (U11F.M2), 02_memory (U10M.B6)
SRAM_D1: 01_fpga (U11F.R4), 02_memory (U10M.C5)
SRAM_D2: 01_fpga (U11F.P2), 02_memory (U10M.C6)
SRAM_D3: 01_fpga (U11F.L4), 02_memory (U10M.D5)
SRAM_D4: 01_fpga (U11F.L1), 02_memory (U10M.E5)
SRAM_D5: 01_fpga (U11F.M1), 02_memory (U10M.F5)
SRAM_D6: 01_fpga (U11F.R1), 02_memory (U10M.F6)
SRAM_D7: 01_fpga (U11F.P1), 02_memory (U10M.G6)
SRAM_D8: 01_fpga (U11F.U3), 02_memory (U10M.B1)
SRAM_D9: 01_fpga (U11F.V2), 02_memory (U10M.C1)
SRAM_D10: 01_fpga (U11F.V4), 02_memory (U10M.C2)
SRAM_D11: 01_fpga (U11F.U2), 02_memory (U10M.D2)
SRAM_D12: 01_fpga (U11F.N2), 02_memory (U10M.E2)
SRAM_D13: 01_fpga (U11F.T1), 02_memory (U10M.F2)
SRAM_D14: 01_fpga (U11F.K6), 02_memory (U10M.F1)
SRAM_D15: 01_fpga (U11F.J6), 02_memory (U10M.G1)
SRAM_D16: 01_fpga (U11F.V16), 02_memory (U11M.B6)
SRAM_D17: 01_fpga (U11F.V15), 02_memory (U11M.C5)
SRAM_D18: 01_fpga (U11F.U17), 02_memory (U11M.C6)
SRAM_D19: 01_fpga (U11F.U18), 02_memory (U11M.D5)
SRAM_D20: 01_fpga (U11F.P17), 02_memory (U11M.E5)
SRAM_D21: 01_fpga (U11F.T18), 02_memory (U11M.F5)
SRAM_D22: 01_fpga (U11F.P18), 02_memory (U11M.F6)
SRAM_D23: 01_fpga (U11F.M17), 02_memory (U11M.G6)
SRAM_D24: 01_fpga (U11F.N3), 02_memory (U11M.B1)
SRAM_D25: 01_fpga (U11F.T4), 02_memory (U11M.C1)
SRAM_D26: 01_fpga (U11F.V13), 02_memory (U11M.C2)
SRAM_D27: 01_fpga (U11F.P15), 02_memory (U11M.D2)
SRAM_D28: 01_fpga (U11F.T14), 02_memory (U11M.E2)
SRAM_D29: 01_fpga (U11F.R15), 02_memory (U11M.F2)
SRAM_D30: 01_fpga (U11F.T3), 02_memory (U11M.F1)
SRAM_D31: 01_fpga (U11F.R7), 02_memory (U11M.G1)
SRAM_DM0: 01_fpga (U11F.V3), 02_memory (U10M.A1)
SRAM_DM1: 01_fpga (U11F.R2), 02_memory (U10M.B2)
SRAM_DM2: 01_fpga (U11F.T5), 02_memory (U11M.A1)
SRAM_DM3: 01_fpga (U11F.T13), 02_memory (U11M.B2)
SRAM_OE_N: 01_fpga (U11F.U12), 02_memory (U10M.A2 U11M.A2)
SRAM_WE_N: 01_fpga (U11F.K4), 02_memory (U10M.G5 U11M.G5)
SRAM_ZZ_N_1.8: 01_fpga (U17F.B1), 02_memory (R10M.2 R12M.1 U10M.A6 U11M.A6)
SYS_ON: 03_power (Q12P.1 R26P.2), 05_kbd_pm (U11K.47)
U_TO_T_ON: 01_fpga (Q13F.1 R28F.2), 05_kbd_pm (U11K.46)
UP5K_CSN: 01_fpga (P12F.5), 05_kbd_pm (R11K.2 U10K.1 U11K.16)
UP5K_KEYCOL0: 01_fpga (P12F.19), 05_kbd_pm (U11K.48 U12K.9)
UP5K_KEYCOL1: 01_fpga (P12F.20), 05_kbd_pm (U11K.3 U12K.10)
UP5K_MISO: 01_fpga (P12F.7), 05_kbd_pm (U10K.2 U11K.17)
UP5K_MOSI: 01_fpga (P12F.6), 05_kbd_pm (U10K.5 U11K.14)
UP5K_RGB0: 01_fpga (P11F.20), 05_kbd_pm (D10K.3 P10K.26 U11K.39)
UP5K_RGB1: 01_fpga (P11F.21), 05_kbd_pm (D10K.2 P10K.27 U11K.40)
UP5K_RGB2: 01_fpga (P11F.22), 05_kbd_pm (D10K.1 P10K.28 U11K.41)
UP5K_SCK: 01_fpga (P12F.8), 05_kbd_pm (R21K.2 U10K.6 U11K.15)
USBC_CC1: 01_fpga (U11F.C17), 03_power (D10P.1 R11P.2)
USBC_CC2: 01_fpga (U11F.E16), 03_power (D11P.1 R12P.1)
VBUS_DIV: 01_fpga (U11F.E12), 03_power (R27P.1 R28P.1)
WIFI_CS: 04_io (U10W.31), 05_kbd_pm (U11K.28)
WIFI_LPCLK: 01_fpga (U11F.N15), 04_io (U10W.23 U11W.2), 05_kbd_pm (U11K.37)
WIFI_MISO: 04_io (U10W.28), 05_kbd_pm (U11K.32)
WIFI_MOSI: 04_io (U10W.27), 05_kbd_pm (U11K.34)
WIFI_PA_ENABLE: 04_io (U10W.4), 05_kbd_pm (U11K.27)
WIFI_RES_N: 04_io (R10W.2 U10W.15), 05_kbd_pm (U11K.26)
WIFI_SCLK: 04_io (U10W.26), 05_kbd_pm (U11K.36)
WIFI_WIRQ: 04_io (U10W.29), 05_kbd_pm (U11K.31)
WIFI_WUP: 04_io (U10W.16), 05_kbd_pm (U11K.38)